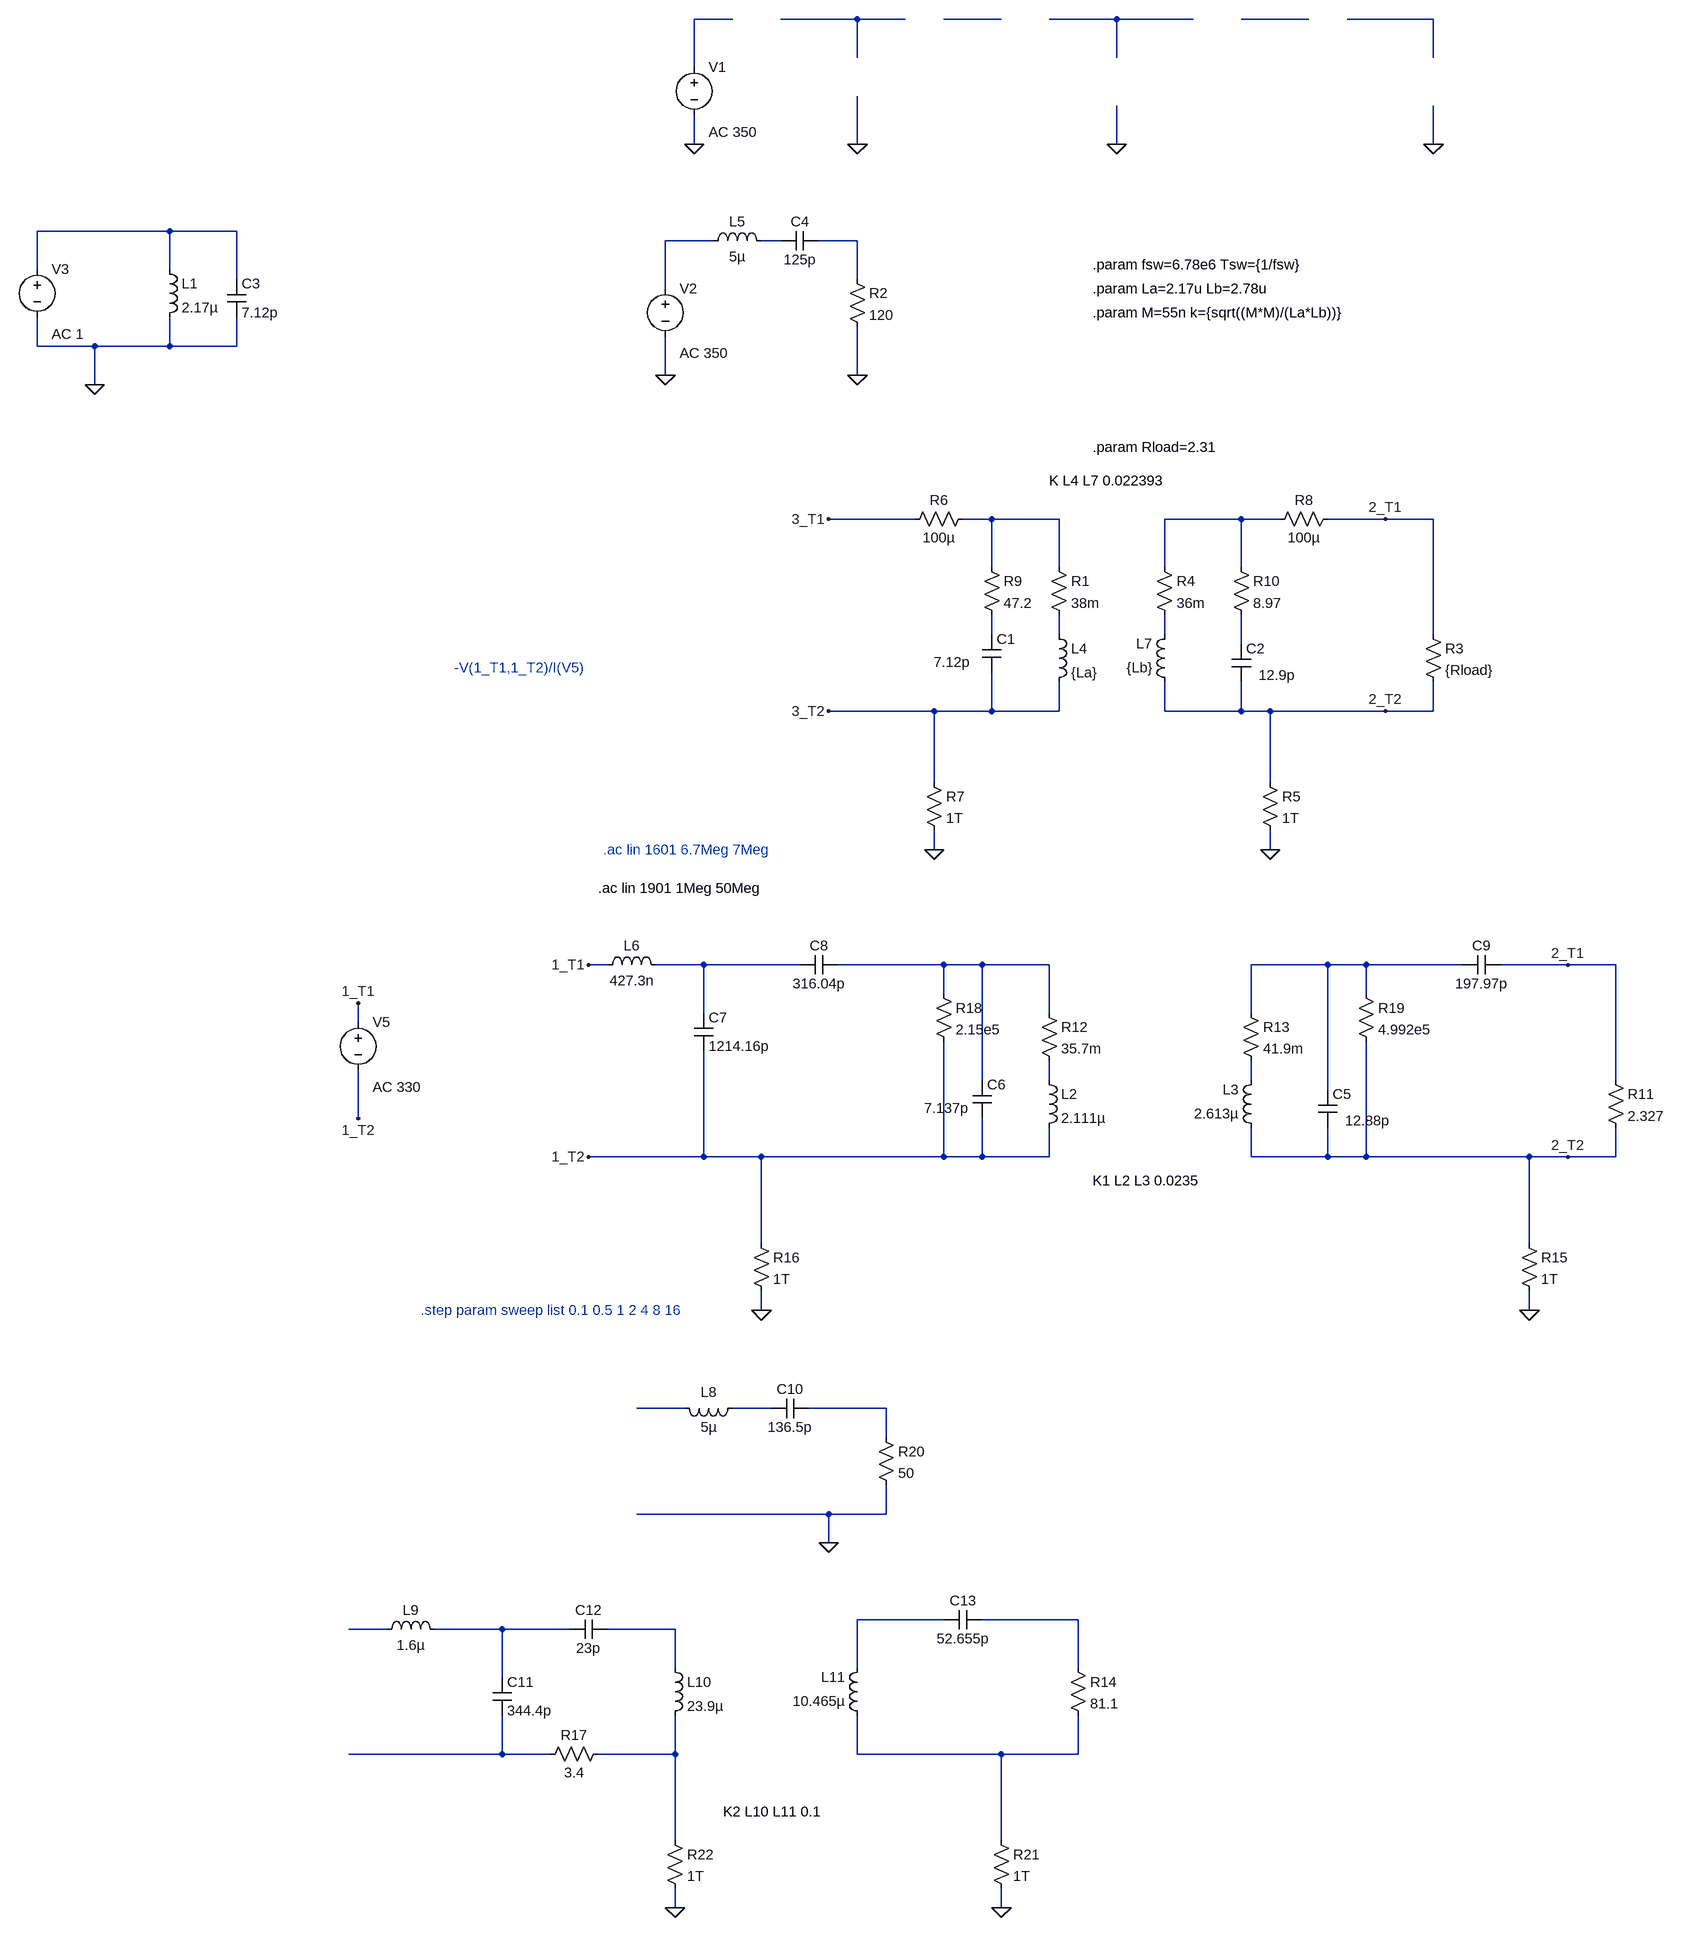
[diagram p0: schematic 0627.asc]
0627.asc, the LTspice schematic file:
Version 4.1
SHEET 1 1468 3332
WIRE -112 48 -176 48
WIRE 96 48 -32 48
WIRE 176 48 96 48
WIRE 336 48 240 48
WIRE 528 48 416 48
WIRE 656 48 528 48
WIRE 848 48 736 48
WIRE 1056 48 912 48
WIRE 96 112 96 48
WIRE 528 112 528 48
WIRE 1056 112 1056 48
WIRE -176 128 -176 48
WIRE -176 256 -176 208
WIRE 96 256 96 176
WIRE 528 256 528 192
WIRE 1056 256 1056 192
WIRE -1152 416 -1376 416
WIRE -1040 416 -1152 416
WIRE -144 432 -224 432
WIRE -32 432 -64 432
WIRE 96 432 32 432
WIRE -1376 480 -1376 416
WIRE -1152 480 -1152 416
WIRE -1040 496 -1040 416
WIRE 96 496 96 432
WIRE -224 512 -224 432
WIRE -1376 608 -1376 560
WIRE -1280 608 -1376 608
WIRE -1152 608 -1152 560
WIRE -1152 608 -1280 608
WIRE -1040 608 -1040 560
WIRE -1040 608 -1152 608
WIRE -224 656 -224 592
WIRE 96 656 96 576
WIRE -1280 672 -1280 608
WIRE 192 896 48 896
WIRE 320 896 272 896
WIRE 432 896 320 896
WIRE 736 896 608 896
WIRE 800 896 736 896
WIRE 976 896 880 896
WIRE 1056 896 976 896
WIRE 320 976 320 896
WIRE 432 976 432 896
WIRE 608 976 608 896
WIRE 736 976 736 896
WIRE 320 1088 320 1056
WIRE 432 1088 432 1056
WIRE 608 1088 608 1056
WIRE 1056 1088 1056 896
WIRE 736 1104 736 1056
WIRE 224 1216 48 1216
WIRE 320 1216 320 1152
WIRE 320 1216 224 1216
WIRE 432 1216 432 1168
WIRE 432 1216 320 1216
WIRE 608 1216 608 1168
WIRE 736 1216 736 1168
WIRE 736 1216 608 1216
WIRE 784 1216 736 1216
WIRE 976 1216 784 1216
WIRE 1056 1216 1056 1168
WIRE 1056 1216 976 1216
WIRE 224 1360 224 1216
WIRE 784 1360 784 1216
WIRE 224 1472 224 1440
WIRE 784 1472 784 1440
WIRE -320 1664 -352 1664
WIRE -160 1664 -240 1664
WIRE 0 1664 -160 1664
WIRE 240 1664 64 1664
WIRE 304 1664 240 1664
WIRE 416 1664 304 1664
WIRE 880 1664 752 1664
WIRE 944 1664 880 1664
WIRE 1104 1664 944 1664
WIRE 1280 1664 1168 1664
WIRE 1360 1664 1280 1664
WIRE 240 1712 240 1664
WIRE 944 1712 944 1664
WIRE -160 1744 -160 1664
WIRE 416 1744 416 1664
WIRE 752 1744 752 1664
WIRE -736 1760 -736 1728
WIRE 304 1856 304 1664
WIRE 416 1856 416 1824
WIRE 752 1856 752 1824
WIRE 1360 1856 1360 1664
WIRE 880 1872 880 1664
WIRE -736 1920 -736 1840
WIRE -160 1984 -160 1808
WIRE -160 1984 -352 1984
WIRE -64 1984 -160 1984
WIRE 240 1984 240 1792
WIRE 240 1984 -64 1984
WIRE 304 1984 304 1920
WIRE 304 1984 240 1984
WIRE 416 1984 416 1936
WIRE 416 1984 304 1984
WIRE 752 1984 752 1936
WIRE 880 1984 880 1936
WIRE 880 1984 752 1984
WIRE 944 1984 944 1792
WIRE 944 1984 880 1984
WIRE 1216 1984 944 1984
WIRE 1280 1984 1216 1984
WIRE 1360 1984 1360 1936
WIRE 1360 1984 1280 1984
WIRE -64 2128 -64 1984
WIRE 1216 2128 1216 1984
WIRE -64 2240 -64 2208
WIRE 1216 2240 1216 2208
WIRE -192 2480 -272 2480
WIRE -48 2480 -112 2480
WIRE 144 2480 16 2480
WIRE 144 2528 144 2480
WIRE 48 2656 -272 2656
WIRE 144 2656 144 2608
WIRE 144 2656 48 2656
WIRE 48 2704 48 2656
WIRE 240 2832 96 2832
WIRE 464 2832 304 2832
WIRE -688 2848 -752 2848
WIRE -496 2848 -608 2848
WIRE -384 2848 -496 2848
WIRE -208 2848 -320 2848
WIRE -208 2912 -208 2848
WIRE 96 2912 96 2832
WIRE 464 2912 464 2832
WIRE -496 2928 -496 2848
WIRE -496 3056 -496 2992
WIRE -496 3056 -752 3056
WIRE -416 3056 -496 3056
WIRE -208 3056 -208 2992
WIRE -208 3056 -336 3056
WIRE 96 3056 96 2992
WIRE 336 3056 96 3056
WIRE 464 3056 464 2992
WIRE 464 3056 336 3056
WIRE -208 3200 -208 3056
WIRE 336 3200 336 3056
WIRE -208 3312 -208 3280
WIRE 336 3312 336 3280
FLAG 96 256 0
FLAG 528 256 0
FLAG -176 256 0
FLAG 1056 256 0
FLAG -224 656 0
FLAG 96 656 0
FLAG 784 1472 0
FLAG -1280 672 0
FLAG 976 896 2_T1
FLAG 976 1216 2_T2
FLAG -736 1920 1_T2
FLAG -736 1728 1_T1
FLAG 224 1472 0
FLAG 1216 2240 0
FLAG 48 896 3_T1
FLAG 48 1216 3_T2
FLAG 1280 1664 2_T1
FLAG 1280 1984 2_T2
FLAG -64 2240 0
FLAG 48 2704 0
FLAG -352 1664 1_T1
FLAG -352 1984 1_T2
FLAG 336 3312 0
FLAG -208 3312 0
SYMBOL voltage -176 112 R0
WINDOW 123 24 124 Left 2
WINDOW 39 0 0 Left 0
SYMATTR Value2 AC 350
SYMATTR InstName V1
SYMATTR Value ""
SYMBOL voltage -224 496 R0
WINDOW 123 24 124 Left 2
WINDOW 39 0 0 Left 0
SYMATTR Value2 AC 350
SYMATTR InstName V2
SYMATTR Value ""
SYMBOL ind -160 448 R270
WINDOW 0 32 56 VTop 2
WINDOW 3 5 56 VBottom 2
SYMATTR InstName L5
SYMATTR Value 5µ
SYMATTR SpiceLine Rser=1m
SYMBOL cap 32 416 R90
WINDOW 0 0 32 VBottom 2
WINDOW 3 32 32 VTop 2
SYMATTR InstName C4
SYMATTR Value 125p
SYMBOL res 80 480 R0
SYMATTR InstName R2
SYMATTR Value 120
SYMBOL res 1040 1072 R0
SYMATTR InstName R3
SYMATTR Value {Rload}
SYMBOL ind 416 1072 R0
SYMATTR InstName L4
SYMATTR Value {La}
SYMATTR Type ind
SYMATTR SpiceLine Rser=1m
SYMBOL ind 624 1184 R180
WINDOW 0 36 80 Left 2
WINDOW 3 36 40 Left 2
SYMATTR InstName L7
SYMATTR Value {Lb}
SYMATTR Type ind
SYMATTR SpiceLine Rser=1m
SYMBOL res 416 960 R0
SYMATTR InstName R1
SYMATTR Value 38m
SYMBOL res 592 960 R0
SYMATTR InstName R4
SYMATTR Value 36m
SYMBOL res 288 880 R90
WINDOW 0 0 56 VBottom 2
WINDOW 3 32 56 VTop 2
SYMATTR InstName R6
SYMATTR Value 100µ
SYMBOL res 768 1344 R0
SYMATTR InstName R5
SYMATTR Value 1T
SYMBOL ind -1168 464 R0
SYMATTR InstName L1
SYMATTR Value 2.17µ
SYMATTR SpiceLine Rser=78m
SYMBOL voltage -1376 464 R0
WINDOW 123 24 124 Left 2
WINDOW 39 0 0 Left 0
SYMATTR Value2 AC 1
SYMATTR InstName V3
SYMATTR Value ""
SYMBOL cap -1056 496 R0
SYMATTR InstName C3
SYMATTR Value 7.12p
SYMBOL voltage -736 1744 R0
WINDOW 123 24 124 Left 2
WINDOW 39 0 0 Left 0
SYMATTR Value2 AC 330
SYMATTR InstName V5
SYMATTR Value ""
SYMBOL res 208 1344 R0
SYMATTR InstName R7
SYMATTR Value 1T
SYMBOL res 896 880 R90
WINDOW 0 0 56 VBottom 2
WINDOW 3 32 56 VTop 2
SYMATTR InstName R8
SYMATTR Value 100µ
SYMBOL res 304 960 R0
SYMATTR InstName R9
SYMATTR Value 47.2
SYMBOL res 720 960 R0
SYMATTR InstName R10
SYMATTR Value 8.97
SYMBOL ind 400 1840 R0
SYMATTR InstName L2
SYMATTR Value 2.111µ
SYMATTR Type ind
SYMATTR SpiceLine Rser=1m
SYMBOL ind 768 1952 R180
WINDOW 0 36 80 Left 2
WINDOW 3 36 40 Left 2
SYMATTR InstName L3
SYMATTR Value 2.613µ
SYMATTR Type ind
SYMATTR SpiceLine Rser=1m
SYMBOL res 400 1728 R0
SYMATTR InstName R12
SYMATTR Value 35.7m
SYMBOL res 736 1728 R0
SYMATTR InstName R13
SYMATTR Value 41.9m
SYMBOL cap 864 1872 R0
WINDOW 3 45 52 Left 2
SYMATTR InstName C5
SYMATTR Value 12.88p
SYMATTR SpiceLine Rser=100u
SYMBOL cap 288 1856 R0
WINDOW 3 -81 47 Left 2
SYMATTR InstName C6
SYMATTR Value 7.137p
SYMATTR SpiceLine Rser=100u
SYMBOL res 1200 2112 R0
SYMATTR InstName R15
SYMATTR Value 1T
SYMBOL res -80 2112 R0
SYMATTR InstName R16
SYMATTR Value 1T
SYMBOL cap 0 1680 R270
WINDOW 0 32 32 VTop 2
WINDOW 3 0 32 VBottom 2
SYMATTR InstName C8
SYMATTR Value 316.04p
SYMBOL cap 1168 1648 R90
WINDOW 0 0 32 VBottom 2
WINDOW 3 32 32 VTop 2
SYMATTR InstName C9
SYMATTR Value 197.97p
SYMBOL ind -208 2464 M90
WINDOW 0 5 56 VBottom 2
WINDOW 3 32 56 VTop 2
SYMATTR InstName L8
SYMATTR Value 5µ
SYMATTR SpiceLine Rser=1m
SYMBOL cap 16 2464 R90
WINDOW 0 0 32 VBottom 2
WINDOW 3 32 32 VTop 2
SYMATTR InstName C10
SYMATTR Value 136.5p
SYMBOL res 128 2512 R0
SYMATTR InstName R20
SYMATTR Value 50
SYMBOL cap 304 1088 R0
WINDOW 3 -81 47 Left 2
SYMATTR InstName C1
SYMATTR Value 7.12p
SYMATTR SpiceLine Rser=100u
SYMBOL cap 720 1104 R0
WINDOW 3 45 52 Left 2
SYMATTR InstName C2
SYMATTR Value 12.9p
SYMATTR SpiceLine Rser=100u
SYMBOL res 1344 1840 R0
SYMATTR InstName R11
SYMATTR Value 2.327
SYMBOL ind -336 1680 R270
WINDOW 0 32 56 VTop 2
WINDOW 3 5 56 VBottom 2
SYMATTR InstName L6
SYMATTR Value 427.3n
SYMATTR SpiceLine Rser=1m
SYMBOL cap -176 1744 R0
SYMATTR InstName C7
SYMATTR Value 1214.16p
SYMBOL ind -704 2864 R270
WINDOW 0 32 56 VTop 2
WINDOW 3 5 56 VBottom 2
SYMATTR InstName L9
SYMATTR Value 1.6µ
SYMATTR SpiceLine Rser=1m
SYMBOL cap -512 2928 R0
SYMATTR InstName C11
SYMATTR Value 344.4p
SYMBOL cap -320 2832 R90
WINDOW 0 0 32 VBottom 2
WINDOW 3 32 32 VTop 2
SYMATTR InstName C12
SYMATTR Value 23p
SYMBOL ind -224 2896 R0
SYMATTR InstName L10
SYMATTR Value 23.9µ
SYMATTR Type ind
SYMATTR SpiceLine Rser=1m
SYMBOL ind 112 3008 R180
WINDOW 0 36 80 Left 2
WINDOW 3 36 40 Left 2
SYMATTR InstName L11
SYMATTR Value 10.465µ
SYMATTR Type ind
SYMATTR SpiceLine Rser=1m
SYMBOL cap 304 2816 R90
WINDOW 0 0 32 VBottom 2
WINDOW 3 32 32 VTop 2
SYMATTR InstName C13
SYMATTR Value 52.655p
SYMBOL res 448 2896 R0
SYMATTR InstName R14
SYMATTR Value 81.1
SYMBOL res -320 3040 R90
WINDOW 0 0 56 VBottom 2
WINDOW 3 32 56 VTop 2
SYMATTR InstName R17
SYMATTR Value 3.4
SYMBOL res 320 3184 R0
SYMATTR InstName R21
SYMATTR Value 1T
SYMBOL res -224 3184 R0
SYMATTR InstName R22
SYMATTR Value 1T
SYMBOL res 224 1696 R0
SYMATTR InstName R18
SYMATTR Value 2.15e5
SYMBOL res 928 1696 R0
SYMATTR InstName R19
SYMATTR Value 4.992e5
TEXT 488 512 Left 2 !.param La=2.17u Lb=2.78u
TEXT 488 472 Left 2 !.param fsw=6.78e6 Tsw={1/fsw}
TEXT 488 776 Left 2 !.param Rload=2.31
TEXT -328 1472 Left 2 ;.ac lin 1601 6.7Meg 7Meg
TEXT 416 832 Left 2 !K L4 L7 0.022393
TEXT 488 552 Left 2 !.param M=55n k={sqrt((M*M)/(La*Lb))}
TEXT -336 1536 Left 2 !.ac lin 1901 1Meg 50Meg
TEXT -576 1144 Left 2 ;-V(1_T1,1_T2)/I(V5)
TEXT 488 2024 Left 2 !K1 L2 L3 0.0235
TEXT -632 2240 Left 2 ;.step param sweep list 0.1 0.5 1 2 4 8 16
TEXT -128 3152 Left 2 !K2 L10 L11 0.1

The netlist it stands for:
* 0627.asc
V1 N001 0 AC 350
V2 N008 0 AC 350
L5 N008 N009 5µ Rser=1m
C4 N010 N009 125p
R2 N010 0 120
R3 2_T1 2_T2 {Rload}
L4 N014 3_T2 {La} Rser=1m
L7 2_T2 N015 {Lb} Rser=1m
R1 N011 N014 38m
R4 N012 N015 36m
R6 N011 3_T1 100µ
R5 2_T2 0 1T
L1 N007 0 2.17µ Rser=78m
V3 N007 0 AC 1
C3 N007 0 7.12p
V5 1_T1 1_T2 AC 330
R7 3_T2 0 1T
R8 2_T1 N012 100µ
R9 N011 N013 47.2
R10 N012 N016 8.97
L2 N020 1_T2 2.111µ Rser=1m
L3 2_T2 N021 2.613µ Rser=1m
R12 N018 N020 35.7m
R13 N019 N021 41.9m
C5 N019 2_T2 12.88p Rser=100u
C6 N018 1_T2 7.137p Rser=100u
R15 2_T2 0 1T
R16 1_T2 0 1T
C8 N017 N018 316.04p
C9 2_T1 N019 197.97p
L8 N022 N023 5µ Rser=1m
C10 N024 N023 136.5p
R20 N024 0 50
C1 N013 3_T2 7.12p Rser=100u
C2 N016 2_T2 12.9p Rser=100u
R11 2_T1 2_T2 2.327
L6 1_T1 N017 427.3n Rser=1m
C7 N017 1_T2 1214.16p
L9 N027 N028 1.6µ Rser=1m
C11 N028 N030 344.4p
C12 N029 N028 23p
L10 N029 N031 23.9µ Rser=1m
L11 N032 N025 10.465µ Rser=1m
C13 N026 N025 52.655p
R14 N026 N032 81.1
R17 N031 N030 3.4
R21 N032 0 1T
R22 N031 0 1T
R18 N018 1_T2 2.15e5
R19 N019 2_T2 4.992e5
.param La=2.17u Lb=2.78u
.param fsw=6.78e6 Tsw={1/fsw}
.param Rload=2.31
* .ac lin 1601 6.7Meg 7Meg
K L4 L7 0.022393
.param M=55n k={sqrt((M*M)/(La*Lb))}
.ac lin 1901 1Meg 50Meg
* -V(1_T1,1_T2)/I(V5)
K1 L2 L3 0.0235
* .step param sweep list 0.1 0.5 1 2 4 8 16
K2 L10 L11 0.1
.backanno
.end